# EAGLE design 32U4-Programmer (EAGLE 6.2)
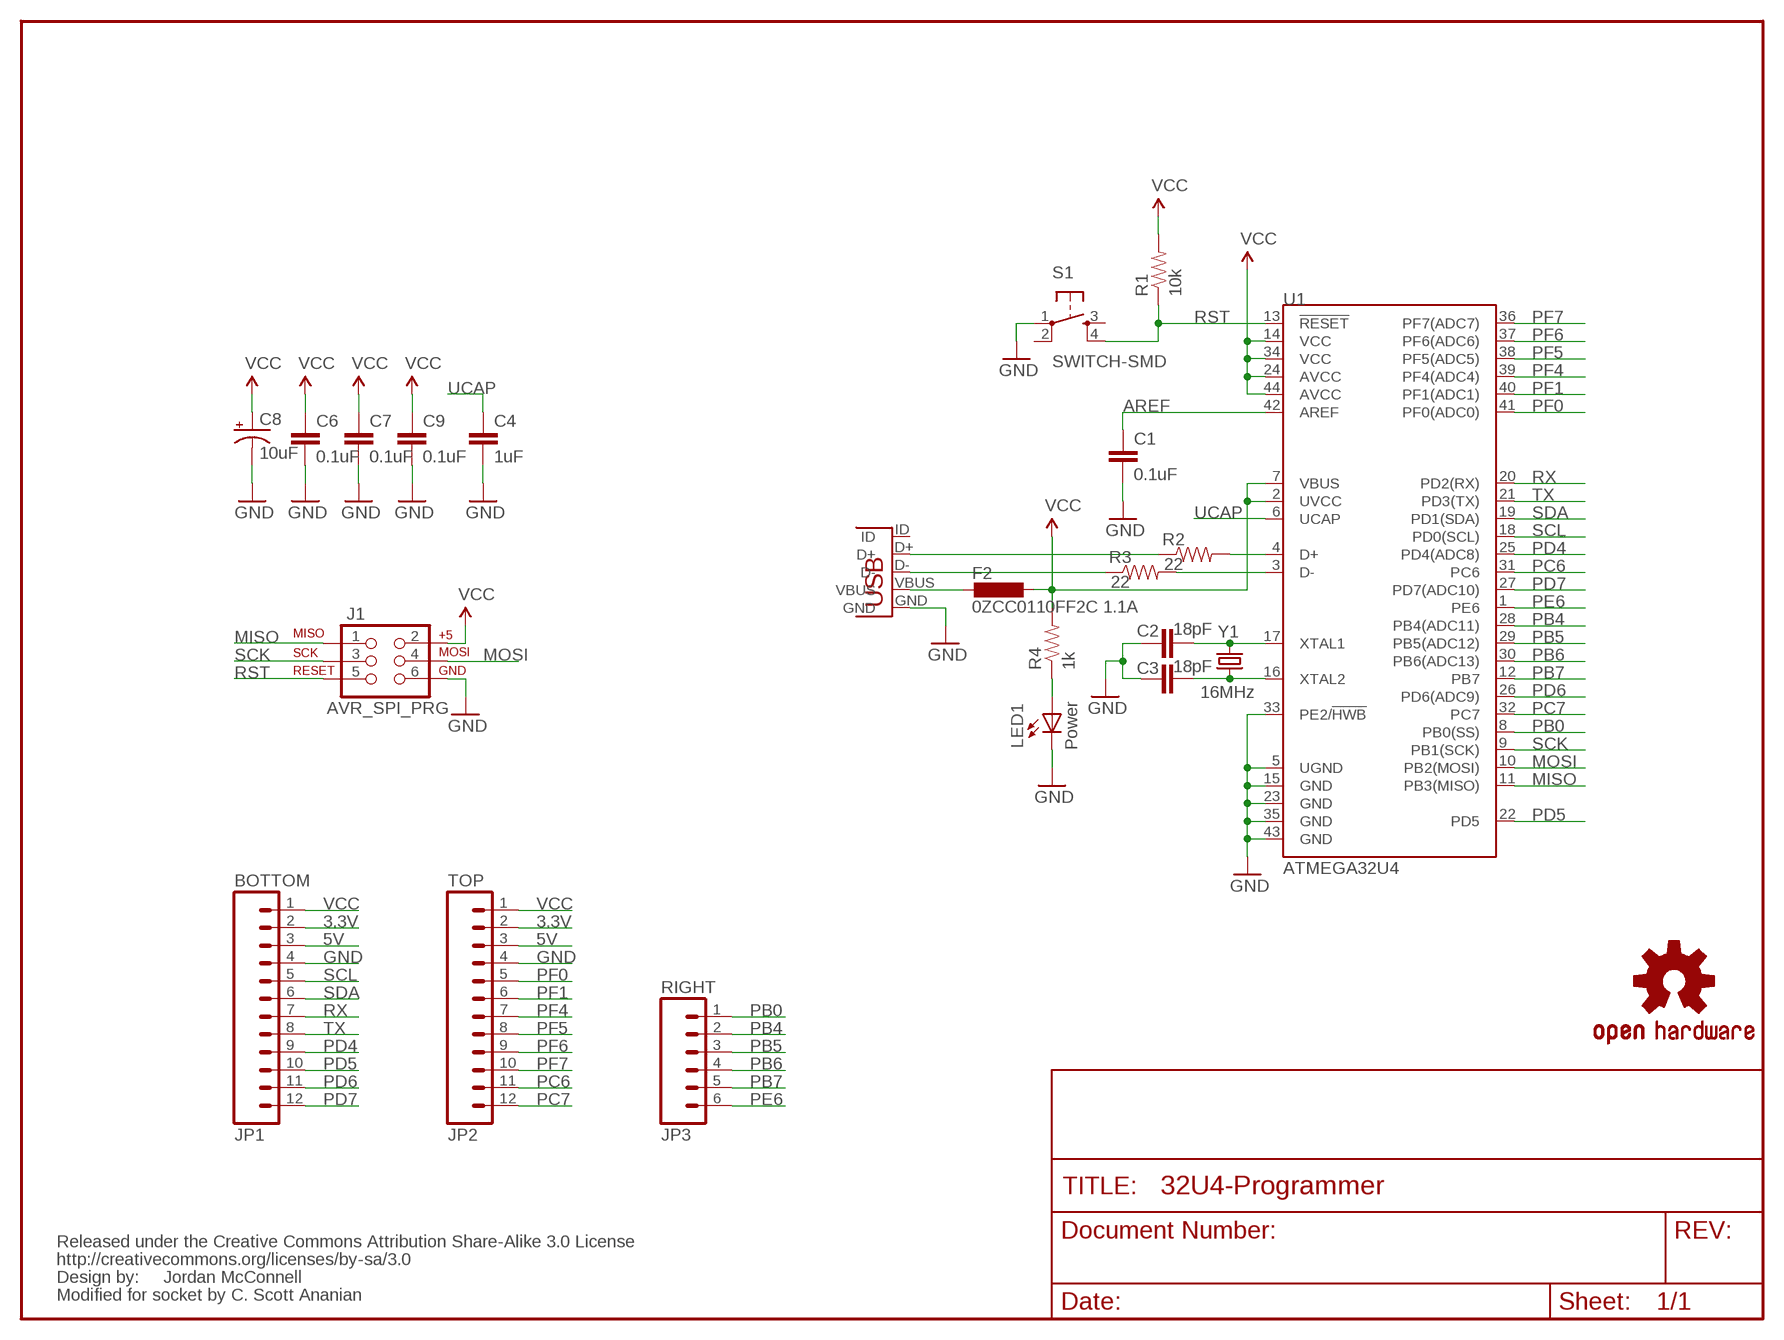
[diagram p0: schematic, sheet 1]

## Parts
C1  0.1uF  CAPPTH  [CAP-PTH-SMALL]
C2  18pF  CAPPTH  [CAP-PTH-SMALL]
C3  18pF  CAPPTH  [CAP-PTH-SMALL]
C4  1uF  CAPPTH  [CAP-PTH-SMALL]
C6  0.1uF  CAPPTH  [CAP-PTH-SMALL]
C7  0.1uF  CAPPTH  [CAP-PTH-SMALL]
C8  10uF  CAP_POLPTH2  [CPOL-RADIAL-10UF-25V]
C9  0.1uF  CAPPTH  [CAP-PTH-SMALL]
F2  0ZCC0110FF2C 1.1A  L-EUL1812  [L1812]
J1  AVR_SPI_PRG  AVR_SPI_PRG_6PTH  [2X3]
JP1  BOTTOM  M12PTH  [1X12]
JP2  TOP  M12PTH  [1X12]
JP3  RIGHT  M06SIP  [1X06]
LED1  Power  LED3MM-KIT  [LED3MM-KIT]
R1  10k  RESISTORAXIAL-0.3  [AXIAL-0.3]
R2  22  RESISTORAXIAL-0.3  [AXIAL-0.3]
R3  22  RESISTORAXIAL-0.3  [AXIAL-0.3]
R4  1k  RESISTORAXIAL-0.3  [AXIAL-0.3]
S1  SWITCH-SMD  TAC_SWITCHPTH  [TACTILE-PTH]
U1  ATMEGA32U4  ATMEGA32U4TQFP44-SOCKET  [TQFP44-SOCKET]
U$6  OSHW-LOGOM  [OSHW-LOGO-M]
U$7  CREATIVE_COMMONS  [CREATIVE_COMMONS]
X1  USBMINIB  [USB-MB-H2]
Y1  16MHz  CRYSTALHC49US  [HC49US]

## Nets
3.3V: JP1.2 JP2.2
5V: JP1.3 JP2.3
AREF: C1.1 U1.42(AREF)
D_M: R3.P$1 X1.D-
D_P: R2.P$1 X1.D+
GND [power]: C1.2 C2.1 C3.1 C4.2 C6.2 C7.2 C8.2(-) C9.2 J1.6 JP1.4 JP2.4 LED1.K(C) S1.1 U1.5(UGND) U1.15(GND) U1.23(GND) U1.33(PE2/!HWB) U1.35(GND) U1.43(GND) X1.GND
MISO: J1.1 U1.11(PB3(MISO))
MOSI: J1.4 U1.10(PB2(MOSI))
N$1 [usbvcc]: F2.2 X1.VBUS
N$2: C2.2 U1.17(XTAL1) Y1.2
N$3: C3.2 U1.16(XTAL2) Y1.1
N$9: LED1.A R4.P$1
PB0: JP3.1 U1.8(PB0(SS))
PB4: JP3.2 U1.28(PB4(ADC11))
PB5: JP3.3 U1.29(PB5(ADC12))
PB6: JP3.4 U1.30(PB6(ADC13))
PB7: JP3.5 U1.12(PB7)
PC6: JP2.11 U1.31(PC6)
PC7: JP2.12 U1.32(PC7)
PD4: JP1.9 U1.25(PD4(ADC8))
PD5: JP1.10 U1.22(PD5)
PD6: JP1.11 U1.26(PD6(ADC9))
PD7: JP1.12 U1.27(PD7(ADC10))
PE6: JP3.6 U1.1(PE6)
PF0: JP2.5 U1.41(PF0(ADC0))
PF1: JP2.6 U1.40(PF1(ADC1))
PF4: JP2.7 U1.39(PF4(ADC4))
PF5: JP2.8 U1.38(PF5(ADC5))
PF6: JP2.9 U1.37(PF6(ADC6))
PF7: JP2.10 U1.36(PF7(ADC7))
RD_M: R3.P$2 U1.3(D-)
RD_P: R2.P$2 U1.4(D+)
RST: J1.5 R1.P$1 S1.4 U1.13(!RESET)
RX: JP1.7 U1.20(PD2(RX))
SCK: J1.3 U1.9(PB1(SCK))
SCL: JP1.5 U1.18(PD0(SCL))
SDA: JP1.6 U1.19(PD1(SDA))
TX: JP1.8 U1.21(PD3(TX))
UCAP: C4.1 U1.6(UCAP)
VCC [power]: C6.1 C7.1 C8.1(+) C9.1 F2.1 J1.2 JP1.1 JP2.1 R1.P$2 R4.P$2 U1.2(UVCC) U1.7(VBUS) U1.14(VCC) U1.24(AVCC) U1.34(VCC) U1.44(AVCC)
Unconnected: S1.2 S1.3 X1.ID

## Notes on the sheet
- Jordan McConnell
- Modified for socket by C. Scott Ananian

## Library data of the parts
C1-C4 C6 C7 C9 = SparkFun-Passives:CAP: Capacitor Standard 0603 ceramic capacitor, and 0.1" leaded capacitor.
C8 = SparkFun-Passives:CAP_POL: Capacitor Polarized These are standard SMD and PTH capacitors. Normally 10uF, 47uF, and 100uF in electrolytic and tantalum varieties. Always verify the external diameter of the through hole cap, it varies with capacity, voltage, and manufacturer. The EIA devices should be standard.
F2 = rcl:L-EU: INDUCTOR, European symbol
J1 = SparkFun:AVR_SPI_PRG_6: AVR ISP 6 Pin This is the reduced ISP connector for AVR programming. Common on Arduino. This footprint will take up less PCB space and can be used with a 10-pin to 6-pin adapter such as SKU: BOB-08508
JP1 JP2 = SparkFun:M12: Header 12 Standard 12-pin 0.1" header. Use with straight break away headers (SKU : PRT-00116), right angle break away headers (PRT-00553), swiss pins (PRT-00743), machine pins (PRT-00117), and female headers (PRT-00115).
JP3 = SparkFun:M06: Header 6 Standard 6-pin 0.1" header. Use with straight break away headers (SKU : PRT-00116), right angle break away headers (PRT-00553), swiss pins (PRT-00743), machine pins (PRT-00117), and female headers (PRT-00115). Molex polarized connector foot print use with SKU : PRT-08094 with associated crimp pins and housings. NOTES ON THE VARIANTS LOCK and LOCK_LONGPADS... This footprint was designed to help hold the alignment of a through-hole component (i.e. 6-pin header) while soldering it into place. You may notice that each hole has been shifted either up or down by 0.005 of an inch from it's more standard position (which is a perfectly straight line). This slight alteration caused the pins (the squares in the middle) to touch the edges of the holes. Because they are alternating, it causes a "brace" to hold the component in place. 0.005 has proven to be the perfect amount of "off-center" position when using our standard breakaway headers. Although looks a little odd when you look at the bare footprint, once you have a header in there, the alteration is very hard to notice. Also, if you push a header all the way into place, it is covered up entirely on the bottom side. This idea of altering the position of holes to aid alignment will be further integrated into the Sparkfun Library for other footprints. It can help hold any component with 3 or more connection pins.
LED1 = xorduino:LED
R1-R4 = SparkFun-Passives:RESISTOR: Resistor Basic schematic elements and footprints for 0603, 1206, and PTH resistors.
S1 = SparkFun-Electromechanical:TAC_SWITCH: Momentary Switch Button commonly used for reset or general input. Spark Fun Electronics SKU : COM-00097
U1 = xorduino:ATMEGA32U4
U$6 = SparkFun:OSHW-LOGO: Open Source Hardware Logo This logo indicates the piece of hardware it is found on incorporates a OSHW license and/or adheres to the definition of open source hardware found here: http://freedomdefined.org/OSHW
U$7 = SparkFun:CREATIVE_COMMONS
X1 = xorduino:USB
Y1 = SparkFun-FreqCtrl:CRYSTAL: Various standard crystals. Proven footprints. Spark Fun Electronics SKU : COM-00534

## Net classes
0 default: width 0.203 mm, drill 0.559 mm, clearance 0.203 mm
1 power: width 0.406 mm, drill 0.559 mm, clearance 0.203 mm
3 usbvcc: width 0.406 mm, drill 0.559 mm, clearance 0.203 mm

## Board
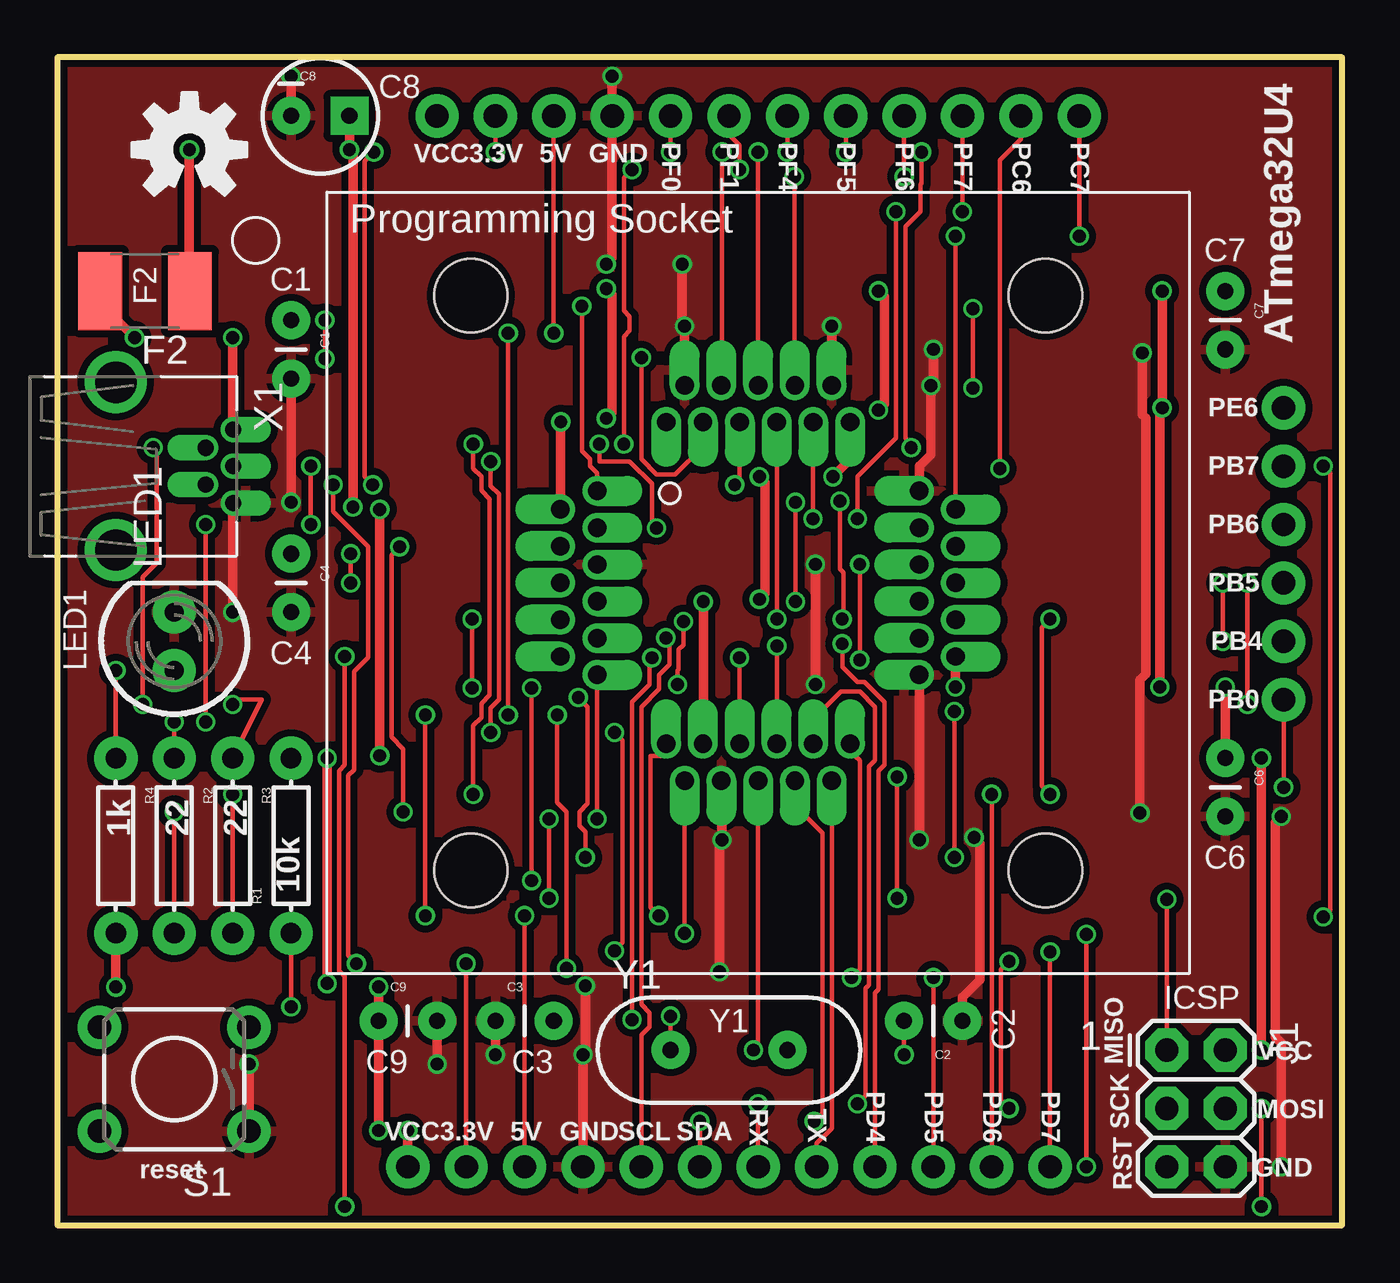
[diagram p1: board, top side]
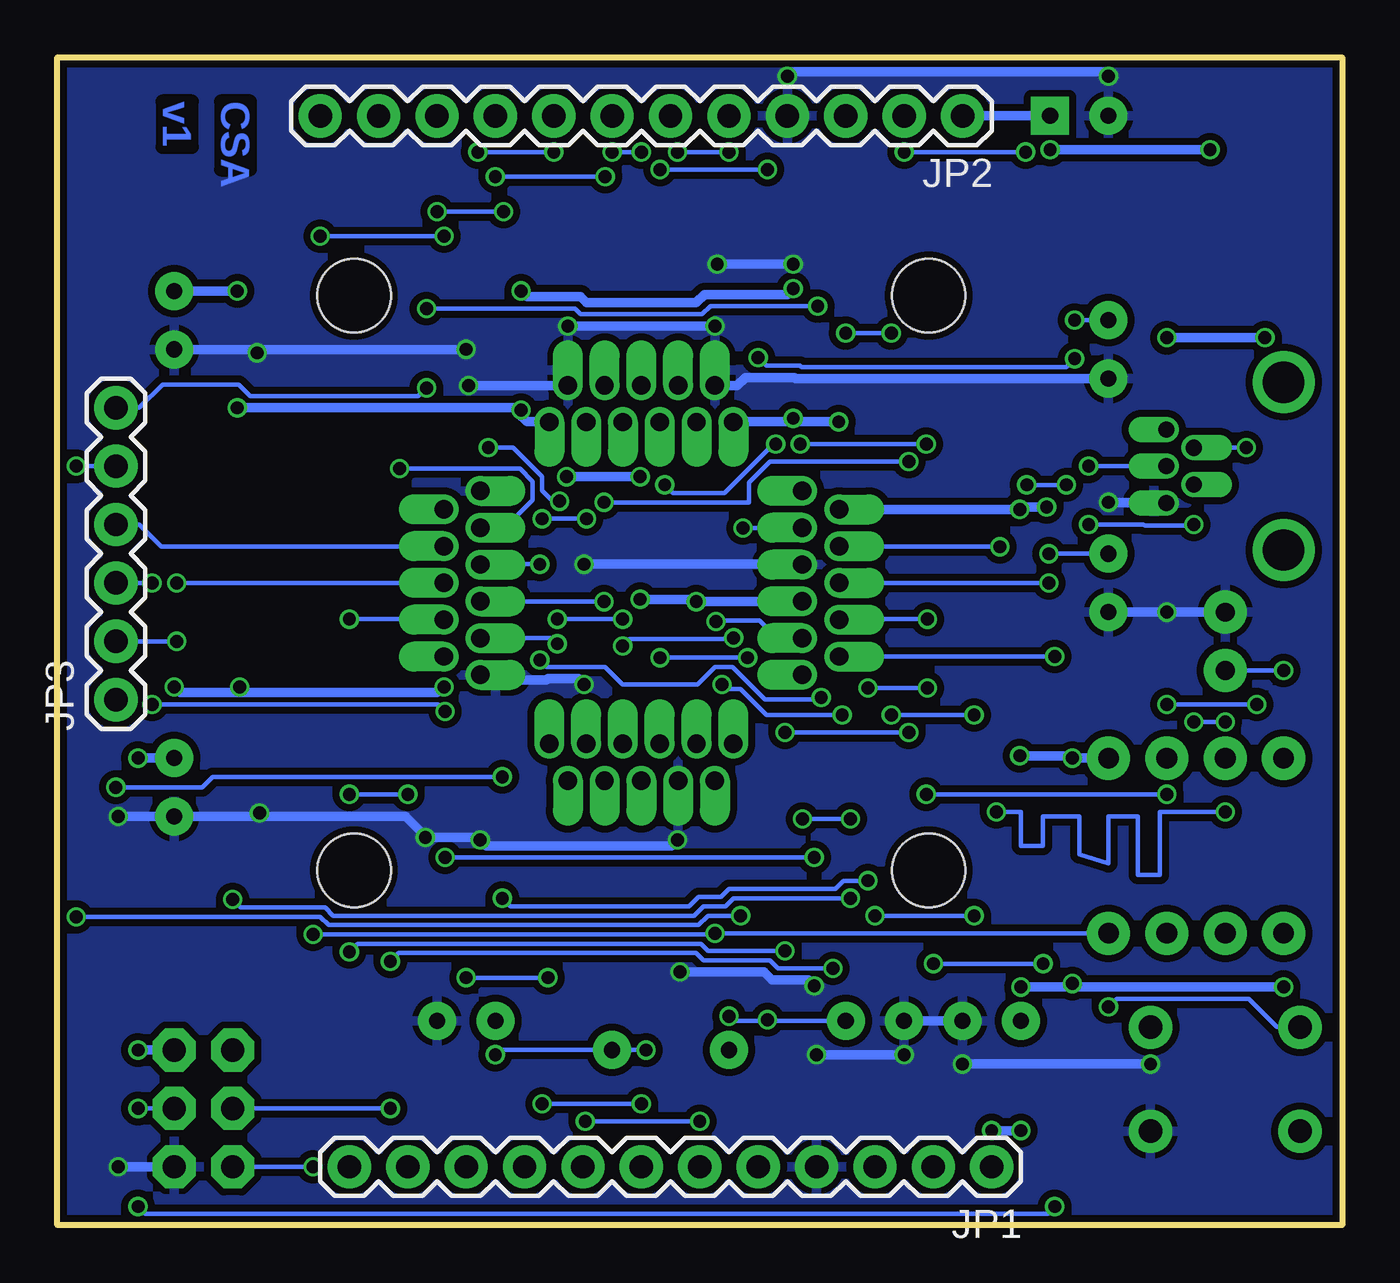
[diagram p2: board, bottom side, seen from below]

Size 55.88 x 50.8 mm. Coordinates in mm from the lower left corner, seen from the top.
Outline: 0,0 55.88,0 55.88,50.8 0,50.8 0,0
Copper layers (1*16): Top 0.035mm / dielectric 1.5mm / Bottom 0.035mm
Design rules: minimum track width 8mil, minimum drill 20mil, track to track 8mil, track to pad 8mil, pad to pad 8mil, via to via 8mil, smd to smd 8mil, copper to edge 10mil, drill to drill 8mil, minimum pad ring 0mil, minimum via ring 0mil, stop-mask expansion 4mil, vias tented up to drill 25mil, thermal gap 10mil

### Footprints (pad centres in the part's own frame; a part is rotated, then mirrored left to right if it is on the bottom)
CAP-PTH-SMALL = drill 0.7 pad 1.651: 1 0,0; 2 2.54,0
CPOL-RADIAL-10UF-25V = drill 0.7 pad 1.651 square: 1 1.27,0 | drill 0.7 pad 1.651: 2 -1.27,0
L1812 = smd 1.9 x 3.4: 1 -1.95,0; 2 1.95,0
2X3 = drill 1.016 pad 1.88 octagon: 1 0,0; 2 0,2.54; 3 2.54,0; 4 2.54,2.54; 5 5.08,0; 6 5.08,2.54
1X12 = drill 1.016 pad 1.88: 1 0,0; 2 2.54,0; 3 5.08,0; 4 7.62,0; 5 10.16,0; 6 12.7,0; 7 15.24,0; 8 17.78,0; 9 20.32,0; 10 22.86,0; 11 25.4,0; 12 27.94,0
1X06 = drill 1.016 pad 1.88: 1 0,0; 2 2.54,0; 3 5.08,0; 4 7.62,0; 5 10.16,0; 6 12.7,0
LED3MM-KIT = drill 0.813 pad 1.88: A -1.27,0; K 1.27,0
AXIAL-0.3 = drill 0.9 pad 1.88: P$1 -3.81,0; P$2 3.81,0
TACTILE-PTH = drill 1.016 pad 1.88: 1 -3.251,2.261; 2 3.251,2.261; 3 -3.251,-2.261; 4 3.251,-2.261
TQFP44-SOCKET = drill 0.8 pad 1.3 offset: 1 -7,4; 2 -8.6,3.2; 3 -7,2.4; 4 -8.6,1.6; 5 -7,0.8; 6 -8.6,0; 7 -7,-0.8; 8 -8.6,-1.6; 9 -7,-2.4; 10 -8.6,-3.2; 11 -7,-4; 12 -4,-7; 13 -3.2,-8.6; 14 -2.4,-7; 15 -1.6,-8.6; 16 -0.8,-7; 17 0,-8.6; 18 0.8,-7; 19 1.6,-8.6; 20 2.4,-7; 21 3.2,-8.6; 22 4,-7; 23 7,-4; 24 8.6,-3.2; 25 7,-2.4; 26 8.6,-1.6; 27 7,-0.8; 28 8.6,0; 29 7,0.8; 30 8.6,1.6; 31 7,2.4; 32 8.6,3.2; 33 7,4; 34 4,7; 35 3.2,8.6; 36 2.4,7; 37 1.6,8.6; 38 0.8,7; 39 0,8.6; 40 -0.8,7; 41 -1.6,8.6; 42 -2.4,7; 43 -3.2,8.6; 44 -4,7 | hole 3.2: -12.5,12.5; 12.5,12.5; 12.5,-12.5; -12.5,-12.5
USB-MB-H2 = drill 0.7 pad 1.1 offset: D+ 5.1,0; D- 3.9,0.8; GND 5.1,-1.6; ID 3.9,-0.8; VBUS 5.1,1.6 | drill 1.8 pad 2.7: P$6 0,-3.65; P$7 0,3.65
HC49US = drill 0.7 pad 1.651: 1 -2.54,0; 2 2.54,0

### Placement (x,y rotation side)
C1  10.16,39.37 270 top
C2  39.37,8.89 180 top
C3  19.05,8.89 0 top
C4  10.16,29.21 270 top
C6  50.8,20.32 270 top
C7  50.8,40.64 270 top
C8  11.43,48.26 0 top
C9  13.97,8.89 0 top
F2  3.81,40.64 180 top
J1  48.26,7.62 270 top
JP1  15.24,2.54 180 bottom
JP2  16.51,48.26 180 bottom
JP3  53.34,22.86 90 bottom
LED1  5.08,25.4 90 top
R1  10.16,16.51 90 top
R2  5.08,16.51 270 top
R3  7.62,16.51 270 top
R4  2.54,16.51 270 top
S1  5.08,6.35 180 top
U1  30.48,27.94 0 top
U$6  5.74,46.79 0 top
U$7  1.27,48.26 0 top
X1  2.54,33.02 0 top
Y1  29.21,7.62 0 top

### Tracks (layer width: path | path; a pad name or v marks a point on that pad's centre or on a via)
3.3V  (via drill 0.56)
  Top 0.203: v17.78,11.38 JP1.2 | v13.01,11.38 12.65,11.73 12.65,19.56 12.9,19.81 12.9,24.08 13.51,24.69 13.51,29.52 11.99,31.04 v11.99,32.21 | v13.72,32.21 13.36,32.56 13.36,46.28 v13.77,46.69 | JP2.2 v19.05,46.69
  Bottom 0.203: v13.01,11.38 v17.78,11.38 | v13.72,32.21 v11.99,32.21 | v19.05,46.69 v13.77,46.69
5V  (via drill 0.56)
  Top 0.203: v20.32,13.46 JP1.3 | v16,22.2 v16,13.46 | v19.61,38.81 v19.61,22.2 | JP2.3 v21.59,38.81
  Bottom 0.203: v16,13.46 v20.32,13.46 | v19.61,22.2 v16,22.2 | v21.59,38.81 v19.61,38.81
AREF  (via drill 0.56)
  Top 0.203: v25.4,37.74 25.4,33.33 26.06,32.66 26.87,32.66 28.09,33.88 28.09,34.9 U1.42 | v11.63,39.37 v11.63,37.69
  Bottom 0.203: v25.4,37.74 25.04,37.39 23.57,37.39 23.52,37.34 11.99,37.34 v11.63,37.69 | C1.1 v11.63,39.37
D_M  (via drill 0.56)
  Top 0.203: v4.17,33.83 4.32,33.68 4.32,28.8 3.71,28.19 v3.71,22.66 | R3.P$1 8.89,22.86 7.62,22.86 v7.62,22.66
  Bottom 0.203: v4.17,33.83 6.4,33.83 X1.D- | v7.62,22.66 v3.71,22.66
D_P  (via drill 0.56)
  Top 0.203: v11.02,30.48 v11.02,33.02 | v6.45,21.89 v6.45,30.48 | R2.P$1 v5.08,21.89
  Bottom 0.203: v11.02,33.02 7.67,33.02 X1.D+ | v11.02,30.48 8.64,30.48 8.59,30.43 6.5,30.43 v6.45,30.48 | v5.08,21.89 v6.45,21.89
GND  (via drill 0.56)
  Top 0.406: v7.62,26.67 7.62,31.39 X1.GND | v10.16,31.45 C1.2 | v10.16,49.99 C8.2 | v24.13,49.99 JP2.4 24.13,48.11 24.13,42.06 v23.88,41.81 | v33.68,39.12 33.68,36.58 U1.35 | U1.43 27.28,36.58 v27.28,39.12 27.18,39.27 v27.18,41.81 | U1.33 37.49,31.95 37.49,33.02 38,33.53 v38,36.52 38.1,36.68 v38.1,38.1 | JP1.4 v22.86,7.42 22.96,7.57 v22.96,10.41 | C3.1 v19.05,7.42 | v8.33,7.01 8.33,4.12 S1.1 | C9.2 v16.51,7.01 | v37.49,16.76 37.49,23.93 U1.23 | U1.15 28.91,19.3 v28.91,16.76 28.8,16.61 v28.8,11.02 | v32.97,23.52 v32.97,28.75 | C2.1 39.37,9.91 40.13,10.67 40.13,16.61 v39.88,16.87 | v53.24,2.54 53.24,7.92 52.98,8.18 52.98,17.53 v53.24,17.78 | v47.19,37.95 47.19,35.26 47.35,35.1 47.35,23.98 47.09,23.72 v47.09,17.93
  Bottom 0.406: LED1.K v7.62,26.67 7.77,26.67 C4.2 | v10.16,31.45 7.67,31.45 X1.GND | v10.16,49.99 10.36,50.19 23.93,50.19 v24.13,49.99 | v33.68,39.12 v27.28,39.12 | v38,36.52 33.68,36.52 U1.35 | v38.1,38.1 47.19,38.1 | 47.19,38.1 C7.2 | v27.18,41.81 v23.88,41.81 | C1.2 23.77,36.83 23.82,36.88 25.96,36.88 26.31,36.52 27.28,36.52 U1.43 | C3.1 C9.2 | v19.05,7.42 v22.86,7.42 | v16.51,7.01 v8.33,7.01 | v28.91,16.76 29.16,16.51 37.24,16.51 v37.49,16.76 37.64,16.87 v39.88,16.87 39.98,17.02 40.74,17.78 47.09,17.78 | v32.97,28.75 23.52,28.75 U1.5 | v32.97,23.52 33.22,23.77 34.54,23.77 34.59,23.72 36.27,23.72 36.47,23.93 37.44,23.93 U1.23 | 47.09,17.78 C6.2 50.95,17.78 v53.24,17.78 | v53.24,2.54 J1.6 | v22.96,10.41 23.22,10.67 24.79,10.67 25.15,11.02 v28.8,11.02 | v47.19,37.95 47.19,38.1 | v47.09,17.93 47.09,17.78
  pour Bottom (isolate 0.305): 55.88,50.8 55.88,0 0,0 0,50.8
  pour Top (isolate 0.305): 55.88,50.8 0,50.8 0,0 55.88,0
MISO  (via drill 0.56)
  Top 0.203: v23.47,17.68 23.47,23.93 U1.11 | v21.39,14.22 v21.39,17.68 | J1.1 v48.26,14.17
  Bottom 0.203: v21.39,17.68 v23.47,17.68 | v21.39,14.22 26.47,14.22 26.82,13.87 27.79,13.87 28.19,13.46 43.89,13.46 44.25,13.82 47.9,13.82 v48.26,14.17
MOSI  (via drill 0.56)
  Top 0.203: v12.5,24.74 12.5,20.02 12.24,19.76 12.24,11.07 12.5,10.82 v12.5,0.81 | v52.38,5.08 v52.38,0.81
  Bottom 0.203: v12.5,24.74 21.84,24.74 U1.10 | v12.5,0.81 12.8,0.51 52.07,0.51 v52.38,0.81 | J1.4 v52.38,5.08
N$1  (via drill 0.56)
  Top 0.406: v7.62,38.61 7.62,34.65 X1.VBUS | v3.35,38.61 2.18,39.78 1.88,39.78 1.88,40.64 F2.2
  Bottom 0.406: v3.35,38.61 v7.62,38.61
N$2  (via drill 0.56)
  Top 0.203: v30.28,7.62 30.48,7.82 30.48,19.3 U1.17 | v36.83,7.42 C2.2
  Bottom 0.203: v30.28,7.62 Y1.2 31.8,7.62 36.63,7.62 v36.83,7.42
N$3  (via drill 0.56)
  Top 0.203: v26.67,9.09 Y1.1 | v29.67,24.69 29.67,20.98 U1.16 | v25.86,24.69 25.76,24.59 25.76,23.52 24.99,22.76 v24.99,8.94
  Bottom 0.203: v26.67,9.09 26.47,8.89 24.99,8.89 | C3.2 24.99,8.89 | v25.86,24.69 v29.67,24.69 | v24.99,8.94 24.99,8.89
N$9  (via drill 0.56)
  Top 0.203: v2.54,24.13 R4.P$1
  Bottom 0.203: LED1.A v2.54,24.13
PB0  (via drill 0.56)
  Top 0.203: v18.03,23.37 v18.03,26.36 | v20.62,14.99 v20.62,23.37 | v36.52,19.51 v36.52,14.22 | JP3.1 v53.34,19.05
  Bottom 0.203: v18.03,26.36 21.84,26.36 U1.8 | v20.62,23.37 v18.03,23.37 | v20.62,14.99 21.69,14.99 22.05,14.63 26.67,14.63 27.03,14.28 27.99,14.28 28.4,13.87 36.17,13.87 v36.52,14.22 | v36.52,19.51 49.12,19.51 49.58,19.05 v53.34,19.05
PB4  (via drill 0.56)
  Top 0.203: v50.7,25.4 v50.7,27.94
  Bottom 0.203: v50.7,27.94 39.12,27.94 U1.28 | JP3.2 v50.7,25.4
PB5  (via drill 0.56)
  Top 0.203: v34.9,24.59 v34.9,28.75 | v22.66,22.96 23.06,22.55 23.06,18.34 22.71,17.98 22.71,17.37 22.96,17.12 v22.96,16 | v39.01,22.35 v39.01,16 | v51.77,27.94 v51.77,22.66
  Bottom 0.203: v34.9,28.75 37.44,28.75 U1.29 | v34.9,24.59 34.59,24.28 32.05,24.28 31.29,23.52 28.04,23.52 27.28,24.28 26.52,24.28 25.09,22.86 22.76,22.86 v22.66,22.96 | v39.01,16 v22.96,16 | v39.01,22.35 39.32,22.66 v51.77,22.66 | JP3.3 v51.77,27.94
PB6
  Bottom 0.203: JP3.4 52.32,30.48 51.36,29.52 39.12,29.52 U1.30
PB7  (via drill 0.56)
  Top 0.203: v26.16,13.46 25.81,13.82 25.81,20.42 26.42,20.42 26.47,20.47 26.47,20.93 U1.12 | v55.07,13.41 55.37,13.72 55.37,32.72 v55.07,33.02
  Bottom 0.203: v26.16,13.46 27.58,13.46 27.99,13.06 44.09,13.06 44.45,13.41 v55.07,13.41 | JP3.5 v55.07,33.02
PC6  (via drill 0.56)
  Top 0.203: v41,32.92 41,46.33 41.91,47.24 JP2.11
  Bottom 0.203: v41,32.92 35.76,32.92 35.2,32.36 35.2,31.55 36.42,30.33 37.44,30.33 U1.31
PC7  (via drill 0.56)
  Top 0.203: v39.06,43.03 39.06,31.14 U1.32 | JP2.12 v44.45,43.03
  Bottom 0.203: v44.45,43.03 v39.06,43.03
PD4  (via drill 0.56)
  Top 0.203: v34.14,25.3 34.14,24.28 34.8,23.62 35.1,23.62 35.97,22.76 35.97,20.02 35.71,19.76 35.71,10.26 35.56,10.11 JP1.9
  Bottom 0.203: v34.14,25.3 34.39,25.55 37.44,25.55 U1.25
PD5  (via drill 0.56)
  Top 0.203: v38.1,10.77 JP1.10 | v34.54,10.77 34.9,11.12 34.9,20.22 34.7,20.42 34.49,20.42 34.49,20.93 U1.22
  Bottom 0.203: v34.54,10.77 v38.1,10.77
PD6  (via drill 0.56)
  Top 0.203: v43.18,26.36 42.82,26.01 42.82,19.1 v43.18,18.75 | JP1.11 v40.64,18.75
  Bottom 0.203: v43.18,26.36 39.12,26.36 U1.26 | v40.64,18.75 v43.18,18.75
PD7  (via drill 0.56)
  Top 0.203: v43.18,11.89 JP1.12 | v24.23,11.94 24.59,12.29 24.59,21.08 v24.23,21.44 | v18.85,21.44 18.85,22.5 19.2,22.86 19.2,31.8 18.85,32.16 v18.85,33.22 | v32.11,27.13 v32.11,31.45
  Bottom 0.203: v43.18,11.89 42.82,12.24 27.89,12.24 27.58,11.94 v24.23,11.94 | v18.85,21.44 v24.23,21.44 | v18.85,33.22 24.89,33.22 25.81,32.31 25.81,31.45 v32.11,31.45 | v32.11,27.13 37.44,27.13 U1.27
PE6  (via drill 0.56)
  Top 0.203: v22.81,39.98 22.81,33.68 23.16,33.33 23.16,33.02 23.47,32.72 23.47,31.95 U1.1 | v39.83,36.42 v39.83,39.88
  Bottom 0.203: v22.81,39.98 27.48,39.98 27.84,39.62 33.12,39.62 33.38,39.88 v39.83,39.88 | v39.83,36.42 40.18,36.07 47.5,36.07 48.01,36.58 51.31,36.58 52.32,35.56 JP3.6
PF0  (via drill 0.56)
  Top 0.203: v28.91,46.69 28.91,36.58 U1.41 | JP2.5 v26.67,46.69
  Bottom 0.203: v26.67,46.69 v28.91,46.69
PF1  (via drill 0.56)
  Top 0.203: v29.46,32.21 29.67,32.41 29.67,34.9 U1.40 | v24.64,33.98 24.64,38.66 24.89,38.91 24.89,39.52 24.64,39.78 24.64,45.57 v24.99,45.92 | v29.67,45.92 29.67,46.99 29.21,47.45 JP2.6
  Bottom 0.203: v29.46,32.21 29.11,31.85 26.87,31.85 24.74,33.98 v24.64,33.98 | v29.67,45.92 v24.99,45.92
PF4  (via drill 0.56)
  Top 0.203: v30.48,46.69 30.48,36.58 U1.39 | JP2.7 v31.75,46.69
  Bottom 0.203: v31.75,46.69 v30.48,46.69
PF5  (via drill 0.56)
  Top 0.203: v31.29,26.36 31.29,34.9 U1.38 | v34.14,26.36 34.19,26.42 34.19,28.4 34.04,28.55 v34.04,31.5 | v37.13,33.83 36.93,34.04 36.93,34.19 36.88,34.24 36.88,43.43 37.54,44.09 37.54,45.26 37.59,45.31 v37.59,46.69 | JP2.8 v34.29,46.69
  Bottom 0.203: v34.14,26.36 v31.29,26.36 | v34.04,31.5 34.34,31.5 34.8,31.95 34.8,32.56 36.07,33.83 v37.13,33.83 | v34.29,46.69 v37.59,46.69
PF6  (via drill 0.56)
  Top 0.203: v32.05,45.62 32.05,36.58 U1.37 | JP2.9 v36.83,45.62
  Bottom 0.203: v36.83,45.62 v32.05,45.62
PF7  (via drill 0.56)
  Top 0.203: v32.87,30.73 32.87,34.9 U1.36 | v34.8,30.73 34.8,32.56 36.47,34.24 v36.47,44.09 | JP2.10 v39.37,44.09
  Bottom 0.203: v34.8,30.73 v32.87,30.73 | v39.37,44.09 v36.47,44.09
RD_M  (via drill 0.56)
  Top 0.203: v26.06,30.33 25.86,30.53 25.86,32.26 24.89,33.22 23.57,33.22 v23.57,33.98 | v18.09,33.98 18.09,32.92 18.44,32.56 18.44,31.95 18.8,31.6 18.8,23.06 18.44,22.71 18.44,22.1 18.09,21.74 v18.09,18.75 | R3.P$2 v7.62,18.75
  Bottom 0.203: v26.06,30.33 23.52,30.33 U1.3 | v18.09,33.98 v23.57,33.98 | v7.62,18.75 v18.09,18.75
RD_P  (via drill 0.56)
  Top 0.203: v14.88,29.52 14.53,29.16 14.53,21.23 15.04,20.73 v15.04,17.98 | R2.P$2 v5.08,17.98
  Bottom 0.203: v14.88,29.52 21.84,29.52 U1.4 | v5.08,17.98 7.92,17.98 7.92,15.24 8.89,15.24 8.89,17.78 10.16,17.78 10.16,15.75 11.43,16.13 11.43,17.78 12.7,17.78 13.01,17.78 13.01,16.51 13.97,16.51 13.97,17.78 13.97,17.98 v15.04,17.98
RST  (via drill 0.56)
  Top 0.203: v27.28,12.7 27.28,19.3 U1.13 | R1.P$1 v10.16,9.5 | v44.76,12.65 v44.76,2.54
  Bottom 0.203: R1.P$1 v27.28,12.7 27.33,12.65 v44.76,12.65 | v10.16,9.5 9.8,9.86 4.06,9.86 2.85,8.64 1.83,8.64 S1.4 | v44.76,2.54 J1.5
RX  (via drill 0.56)
  Top 0.203: v34.8,5.28 35.15,5.64 35.15,10.31 35.31,10.46 35.31,19.96 35.56,20.22 35.56,22.55 34.9,23.22 34.09,23.22 32.87,22 32.87,20.98 U1.20 | JP1.7 v30.48,5.28
  Bottom 0.203: v30.48,5.28 v34.8,5.28
SCK  (via drill 0.56)
  Top 0.203: v41.4,5.08 41.05,5.44 41.05,11.12 v41.4,11.48 | v22.15,11.18 22.15,17.98 21.74,18.39 v21.74,22.2 | v26.98,23.52 26.98,24.13 27.03,24.18 27.03,25.04 27.23,25.25 v27.23,26.26
  Bottom 0.203: v41.4,5.08 J1.3 | v41.4,11.48 41.05,11.84 28.09,11.84 27.79,11.53 24.89,11.53 24.54,11.18 v22.15,11.18 | v21.74,22.2 25.04,22.2 26.16,23.32 26.77,23.32 v26.98,23.52 | v27.23,26.26 27.18,26.31 25.35,26.31 24.59,25.55 23.52,25.55 U1.9
SCL  (via drill 0.56)
  Top 0.203: v31.29,25.2 31.29,20.98 U1.18 | v26.47,25.55 26.62,25.4 26.62,24.38 26.16,23.93 26.16,23.32 25.4,22.55 25.4,9.6 25.76,9.25 25.76,8.64 25.4,8.28 JP1.5
  Bottom 0.203: v31.29,25.2 30.99,25.5 26.52,25.5 v26.47,25.55
SDA  (via drill 0.56)
  Top 0.203: v32.92,4.52 33.27,4.88 33.27,17.07 32.05,18.29 32.05,19.3 U1.19 | JP1.6 v27.94,4.52
  Bottom 0.203: v27.94,4.52 v32.92,4.52
TX
  Top 0.203: JP1.8 33.02,3.56 33.68,4.22 33.68,19.3 U1.21
UCAP  (via drill 0.56)
  Top 0.203: v12.75,29.21 v12.75,27.94
  Bottom 0.203: v12.75,27.94 21.84,27.94 U1.6 | C4.1 v12.75,29.21
VCC  (via drill 0.56)
  Top 0.406: v39.06,23.42 39.06,24.74 U1.24 | C6.1 v50.8,23.42 | v52.38,20.32 v52.38,7.62 | v28.09,27.13 28.09,20.98 U1.14 | v33.73,32.56 34.49,33.33 34.49,34.9 U1.34 | v30.53,32.56 30.79,32.31 30.79,27.48 v30.53,27.23 | v48.06,40.64 v48.06,35.56 47.95,35.41 v47.95,23.42 | v5.74,46.79 5.74,40.64 F2.1 | C8.1 v12.7,46.79 12.85,46.69 v12.85,31.24 | v21.89,34.95 21.89,31.14 U1.2 | v13.97,4.12 C9.1 13.97,9.04 v13.97,10.36 | JP1.1 v15.24,4.12 | v2.54,10.36 R4.P$2 | v11.73,10.52 v11.73,20.32 | v14.02,20.42 v14.02,31.14 | v35.71,35.46 35.97,35.71 35.97,40.39 v35.71,40.64 | v23.88,40.74 24.13,40.49 24.13,35.36 v23.88,35.1
  Bottom 0.406: v39.06,23.42 39.27,23.22 39.32,23.22 39.37,23.16 47.95,23.16 | 47.95,23.16 50.55,23.16 v50.8,23.42 | v52.38,7.62 J1.2 | C6.1 v52.38,20.32 | U1.7 23.52,27.13 v28.09,27.13 28.25,27.23 v30.53,27.23 | v30.53,32.56 v33.73,32.56 | v48.06,40.64 C7.1 | v48.06,35.56 36.07,35.56 35.84,35.33 | 35.84,35.33 35.46,34.95 34.49,34.95 U1.34 | v47.95,23.42 47.95,23.32 47.95,23.16 | JP2.1 C8.1 | v12.7,46.79 v5.74,46.79 | 23.88,34.95 26.47,34.95 U1.44 | 23.88,34.95 v21.89,34.95 | v15.24,4.12 v13.97,4.12 | v13.97,10.36 11.73,10.36 | 11.73,10.36 v2.54,10.36 | R1.P$2 v11.73,20.32 11.89,20.42 v14.02,20.42 | v11.73,10.52 11.73,10.36 | U1.2 21.84,31.14 v14.02,31.14 13.87,31.24 v12.85,31.24 | v35.71,40.64 35.46,40.39 33.12,40.39 32.87,40.13 28.09,40.13 27.74,40.49 24.13,40.49 v23.88,40.74 | v35.71,35.46 35.84,35.33 | v23.88,35.1 23.88,34.95

### Text on the board
Bottom: CSA | v1
tPlace: C8 | PF0 | PF1 | PF4 | PF5 | PF6 | PF7 | PC6 | PC7 | VCC | 3.3V | 5V | GND | Programming Socket | C7 | F2 | C1 | ATmega32U4 | PE6 | PB7 | PB6 | PB5 | C4 | PB4 | LED1 | PB0 | C6 | Y1 | ICSP | C9 | C3 | C2 | 1 | VCC | MISO | PD4 | PD5 | PD6 | PD7 | RX | TX | MOSI | VCC | 3.3V | 5V | GND | SCL | SDA | SCK | GND | reset | RST
tValues: Jordan McConnell